# EAGLE design Right_Bar (EAGLE 9.1.1)
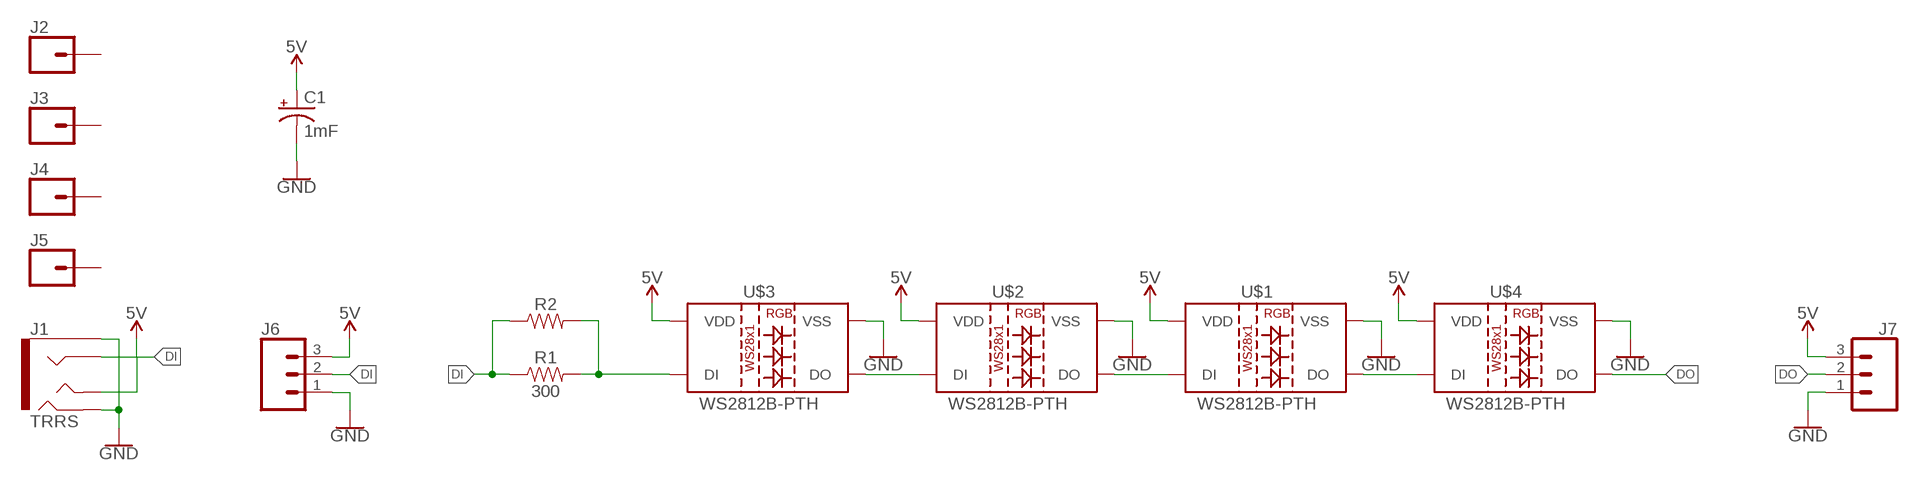
[diagram p0: schematic, sheet 1]

## Parts
C1  1mF  1000UF-RADIAL-5MM-25V-20%  [CPOL-RADIAL-5MM-10MM]
J1  TRRS  AUDIO_JACK_TRRSSMD_RA  [AUDIO_JACK_3.5MM_TRRS_SMD_RA]
J2  CONN_01OFFSET  [1X01_OFFSET]
J3  CONN_01OFFSET  [1X01_OFFSET]
J4  CONN_01OFFSET  [1X01_OFFSET]
J5  CONN_01OFFSET  [1X01_OFFSET]
J6  CONN_03  [1X03]
J7  CONN_03  [1X03]
R1  300  300OHM-0603-1/10W-1%  [0603]
R2  RESISTORAXIAL-0.3  [AXIAL-0.3]
U$1  WS2812B-PTH  [WS2812B-PTH-KIT]
U$2  WS2812B-PTH  [WS2812B-PTH-KIT]
U$3  WS2812B-PTH  [WS2812B-PTH-KIT]
U$4  WS2812B-PTH  [WS2812B-PTH-KIT]

## Nets
5V: C1.+ J1.TIP J6.3 J7.3 U$1.2(VDD) U$2.2(VDD) U$3.2(VDD) U$4.2(VDD)
DI: J1.RING1 J6.2 R1.1 R2.P$1
DO: J7.2 U$4.4(DO)
GND: C1.- J1.EARTH J1.RING2 J6.1 J7.1 U$1.3(VSS) U$2.3(VSS) U$3.3(VSS) U$4.3(VSS)
N$1: U$1.4(DO) U$4.1(DI)
N$2: R1.2 R2.P$2 U$3.1(DI)
N$7: U$2.1(DI) U$3.4(DO)
N$8: U$1.1(DI) U$2.4(DO)
Unconnected: J2.1 J3.1 J4.1 J5.1

## Library data of the parts
C1 = SparkFun-Capacitors:1000UF: 1,000µF/1mF ceramic capacitors A capacitor is a passive two-terminal electrical component used to store electrical energy temporarily in an electric field. CAP-08070; PROD_ID: CAP-09538
J1 = SparkFun-Connectors:AUDIO_JACK_TRRS: Audio Jack - 3.5mm TRRS (SMD) This is a 3.5mm TRRS SMD audio jack. TRRS connectors are the audio-style connectors that you see on some phones, MP3 players and development boards. TRRS stands for “tip, ring, ring, sleeve,” which reflects that this has three conductors and a ground. SparkFun Products: Audio Jack <https://www.sparkfun.com/products/12639> mbed Starter Kit <https://www.sparkfun.com/products/12968> SparkFun TRRS 3.5mm Jack Breakout <https://www.sparkfun.com/products/11570>; PROD_ID: CONN-10676; SF_ID: PRT-12639
J2-J5 = SparkFun-Connectors:CONN_01: Single connection point. Often used as Generic Header-pin footprint for 0.1 inch spaced/style header connections On any of the 0.1 inch spaced packages, you can populate with these: Break Away Headers - Straight <https://www.sparkfun.com/products/116> (PRT-00116) Break Away Male Headers - Right Angle <https://www.sparkfun.com/products/553> (PRT-00553) Female Headers <https://www.sparkfun.com/products/115> (PRT-00115) Break Away Headers - Machine Pin <https://www.sparkfun.com/products/117> (PRT-00117) Break Away Female Headers - Swiss Machine Pin <https://www.sparkfun.com/products/743> (PRT-00743) This device is also useful as a general connection point to wire up your design to another part of your project. Our various solder wires solder well into these plated through hole pads. Hook-Up Wire - Assortment (Stranded, 22 AWG) <https://www.sparkfun.com/products/11375> (PRT-11375) Hook-Up Wire - Assortment (Solid Core, 22 AWG) <https://www.sparkfun.com/products/11367> (PRT-11367) View the entire wire category on our website here <https://www.sparkfun.com/categories/141> Special notes: SMTSO-256-ET is a "flush mount" nut for a 4-40 screw. We mostly use this on specialty testbeds; it is a nice way to connect hardware to your PCB at an adjustable hieght. Also note, the SNAP packages are for using a snappable style connector. We sell a baggie of snaps and they are also used on two LilyPad designs: Snap Assortment - 30 pack (male and female) <https://www.sparkfun.com/products/11347> (DEV-11347) LilyPad Arduino SimpleSnap <https://www.sparkfun.com/products/10941> (DEV-10941) LilyPad SimpleSnap Protoboard <https://www.sparkfun.com/products/10940> (DEV-10940)
J6 J7 = SparkFun-Connectors:CONN_03: Multi connection point. Often used as Generic Header-pin footprint for 0.1 inch spaced/style header connections On any of the 0.1 inch spaced packages, you can populate with these: Break Away Headers - Straight <https://www.sparkfun.com/products/116> (PRT-00116) Break Away Male Headers - Right Angle <https://www.sparkfun.com/products/553> (PRT-00553) Female Headers <https://www.sparkfun.com/products/115> (PRT-00115) Break Away Headers - Machine Pin <https://www.sparkfun.com/products/117> (PRT-00117) Break Away Female Headers - Swiss Machine Pin <https://www.sparkfun.com/products/743> (PRT-00743) Stackable Header - 3 Pin (Female, 0.1") <https://www.sparkfun.com/products/13875> (PRT-13875) For SCREWTERMINALS and SPRING TERMINALS visit here: Screw Terimnals on SparkFun.com <https://www.sparkfun.com/search/results?term=Screw+Terminals> (5mm/3.5mm/2.54mm spacing) This device is also useful as a general connection point to wire up your design to another part of your project. Our various solder wires solder well into these plated through hole pads. Hook-Up Wire - Assortment (Stranded, 22 AWG) <https://www.sparkfun.com/products/11375> (PRT-11375) Hook-Up Wire - Assortment (Solid Core, 22 AWG) <https://www.sparkfun.com/products/11367> (PRT-11367) View the entire wire category on our website here <https://www.sparkfun.com/categories/141> Special notes: Molex polarized connector foot print use with SKU : PRT-08232 with associated crimp pins and housings.; PROD_ID: XXX-00000; VALUE: 455-1750-1-ND
R1 = SparkFun-Resistors:300OHM: 300Ω resistor A resistor is a passive two-terminal electrical component that implements electrical resistance as a circuit element. Resistors act to reduce current flow, and, at the same time, act to lower voltage levels within circuits. - Wikipedia; PROD_ID: RES_10328
R2 = SparkFun-Resistors:RESISTOR: Generic Resistor Package
U$1-U$4 = SparkFun-LED:WS2812B-PTH: WS2812B PTH addressable RGB LED 5mm PTH LED with built-in controller IC. Color: Red/Green/Blue mC Rating: RGB: 390, 660, 180 mcd Forward Voltage: RGB: 2.0, 3.0, 3.0 V SparkFun Products: LED - RGB Addressable, PTH, 5mm Diffused (5 Pack) <https://www.sparkfun.com/products/12986> LED - RGB Addressable, PTH, 5mm Clear (5 Pack) <https://www.sparkfun.com/products/12999> Datasheet referenced for footprint: WS2812B-PTH <https://cdn.sparkfun.com/datasheets/Components/LED/COM-12877.pdf>

## Board
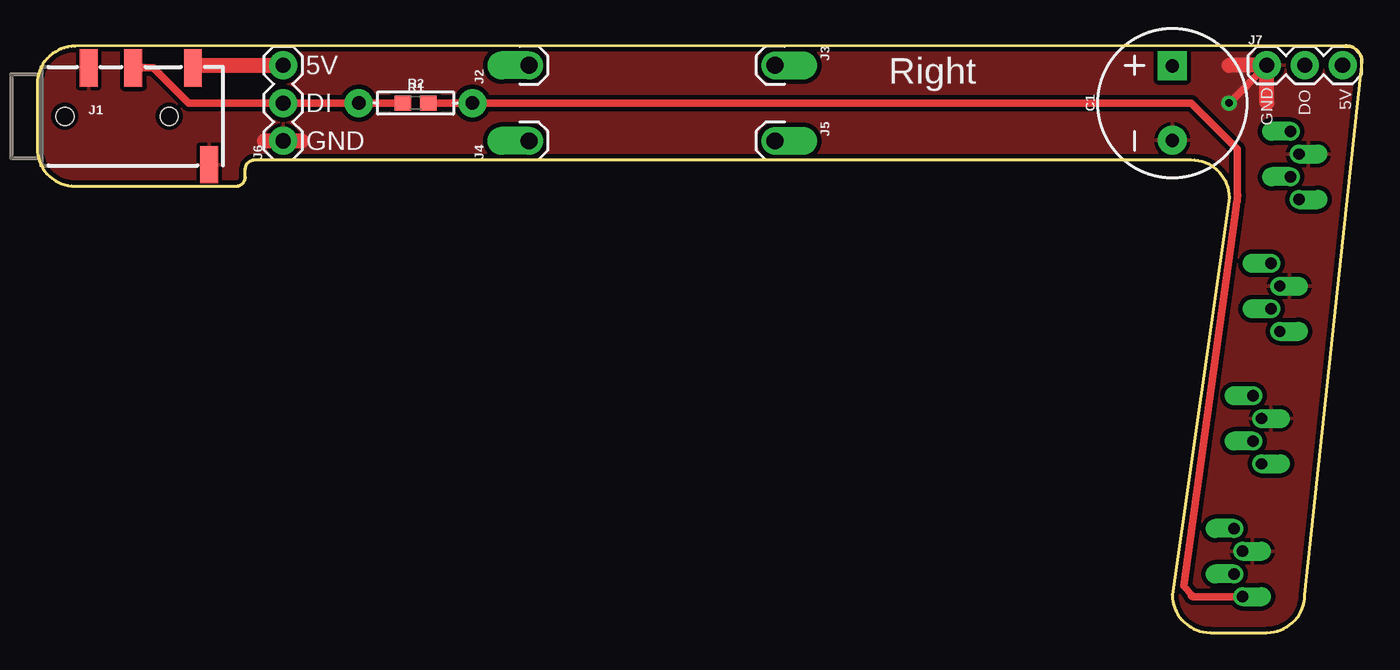
[diagram p1: board, top side]
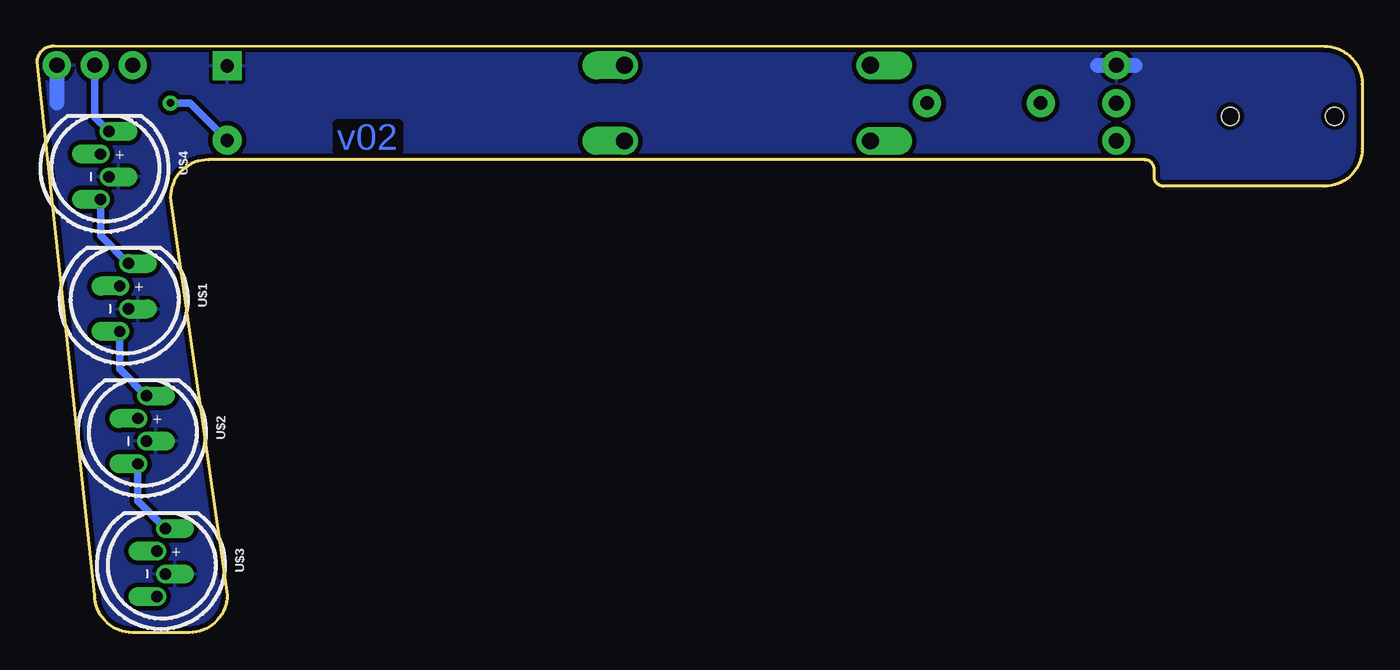
[diagram p2: board, bottom side, seen from below]

Size 88.95 x 39.4 mm. Coordinates in mm from the lower left corner, seen from the top.
Outline: 0,36.83 0,32.51 arc90 2.54,29.97 13.34,29.97 arc90 13.97,30.61 13.97,31.11 arc-90 14.61,31.75 77.47,31.75 arc-90 80.01,29.21 76.2,2.54 arc90 78.74,0 82.55,0 arc90 85.09,2.54 88.95,38.35 arc90 87.81,39.4 2.54,39.37 arc90 0,36.83
Copper layers (1*16): Top 0.035mm / dielectric 1.5mm / Bottom 0.035mm
Design rules "SparkFun-2-layer-STANDARD": minimum track width 10mil, minimum drill 20mil, track to track 10mil, track to pad 8mil, pad to pad 8mil, via to via 10mil, smd to smd 8mil, copper to edge 8mil, drill to drill 8mil, minimum pad ring 10mil, minimum via ring 10mil, stop-mask expansion 4mil, vias tented up to drill 25mil, thermal gap 10mil

### Footprints (pad centres in the part's own frame; a part is rotated, then mirrored left to right if it is on the bottom)
CPOL-RADIAL-5MM-10MM = drill 0.9 pad 1.93 square: + 2.5,0 | drill 0.9 pad 1.93: - -2.5,0
AUDIO_JACK_3.5MM_TRRS_SMD_RA = smd 1.2 x 2.5: EARTH 11.3,-3.25; RING1 6.2,3.25; RING2 3.2,3.25; TIP 10.2,3.25 | hole 1.2: 1.6,0; 8.6,0
1X01_OFFSET = drill 1.118 pad 1.88 offset: 1 0,0
1X03 = drill 1.016 pad 1.88: 1 0,0; 2 2.54,0; 3 5.08,0
0603 = smd 1.1 x 1: 1 -0.85,0; 2 0.85,0
AXIAL-0.3 = drill 0.9 pad 1.88: P$1 -3.81,0; P$2 3.81,0
WS2812B-PTH-KIT = drill 0.762 pad 1.27 offset: 1 2.413,0.079; 2 0.889,0.651; 3 -0.635,0.079; 4 -2.159,0.651

### Placement (x,y rotation side)
C1  76.2,35.56 90 top
J1  0.25,34.67 0 top
J2  33.02,38.1 90 top
J3  49.53,38.1 270 top
J4  33.02,33.02 90 top
J5  49.53,33.02 270 top
J6  16.51,33.02 90 top
J7  82.55,38.1 0 top
R1  25.4,35.56 0 top
R2  25.4,35.56 0 top
U$1  83.49,22.63 270 bottom
U$2  82.27,13.74 270 bottom
U$3  81,4.83 270 bottom
U$4  84.79,31.5 270 bottom

### Tracks (layer width: path | path; a pad name or v marks a point on that pad's centre or on a via)
5V
  Top 1.016: J1.TIP 10.45,38.1 J6.3
  Bottom 1.016: 17.78,38.1 15.24,38.1 | J7.3 87.63,35.56
  pour Bottom (isolate 0.305): 0,0 0,39.37 88.9,39.37 88.9,0
DI
  Top 0.508: J1.RING1 7.8,37.92 10.16,35.56 J6.2 R2.P$1 R1.1
DO
  Bottom 0.508: J7.2 85.09,34.61 U$4.4
GND  (via drill 0.51)
  Top 0.508: C1.- 76.24,33.06 | J7.1 v80.01,35.56
  Top 1.016: 15.24,33.02 17.78,33.02 | 82.55,35.56 J7.1 80.01,38.1
  Bottom 0.508: v80.01,35.56 78.7,35.56 C1.-
  other vias: 82.55,38.1
  pour Top (isolate 0.305): 0,0 88.9,0 88.9,39.37 0,39.37
N$1
  Bottom 0.508: U$4.1 84.71,26.66 U$1.4
N$2
  Top 0.508: R1.2 R2.P$2 77.47,35.56 80.57,32.46 80.57,29.4 80.6,29.36 80.57,29.17 80.57,28.98 80.54,28.95 80.39,27.89 76.96,3.15 77.47,2.54 arc90 77.6,2.41 U$3.1
N$7
  Bottom 0.508: U$2.1 82.19,8.83 U$3.4
N$8
  Bottom 0.508: U$1.1 83.41,17.69 U$2.4

### Text on the board
Bottom: v02
tPlace: 5V | Right | GND | 5V | DO | DI | GND